# EAGLE design CO2 sensor v1.1_print (EAGLE 6.3)
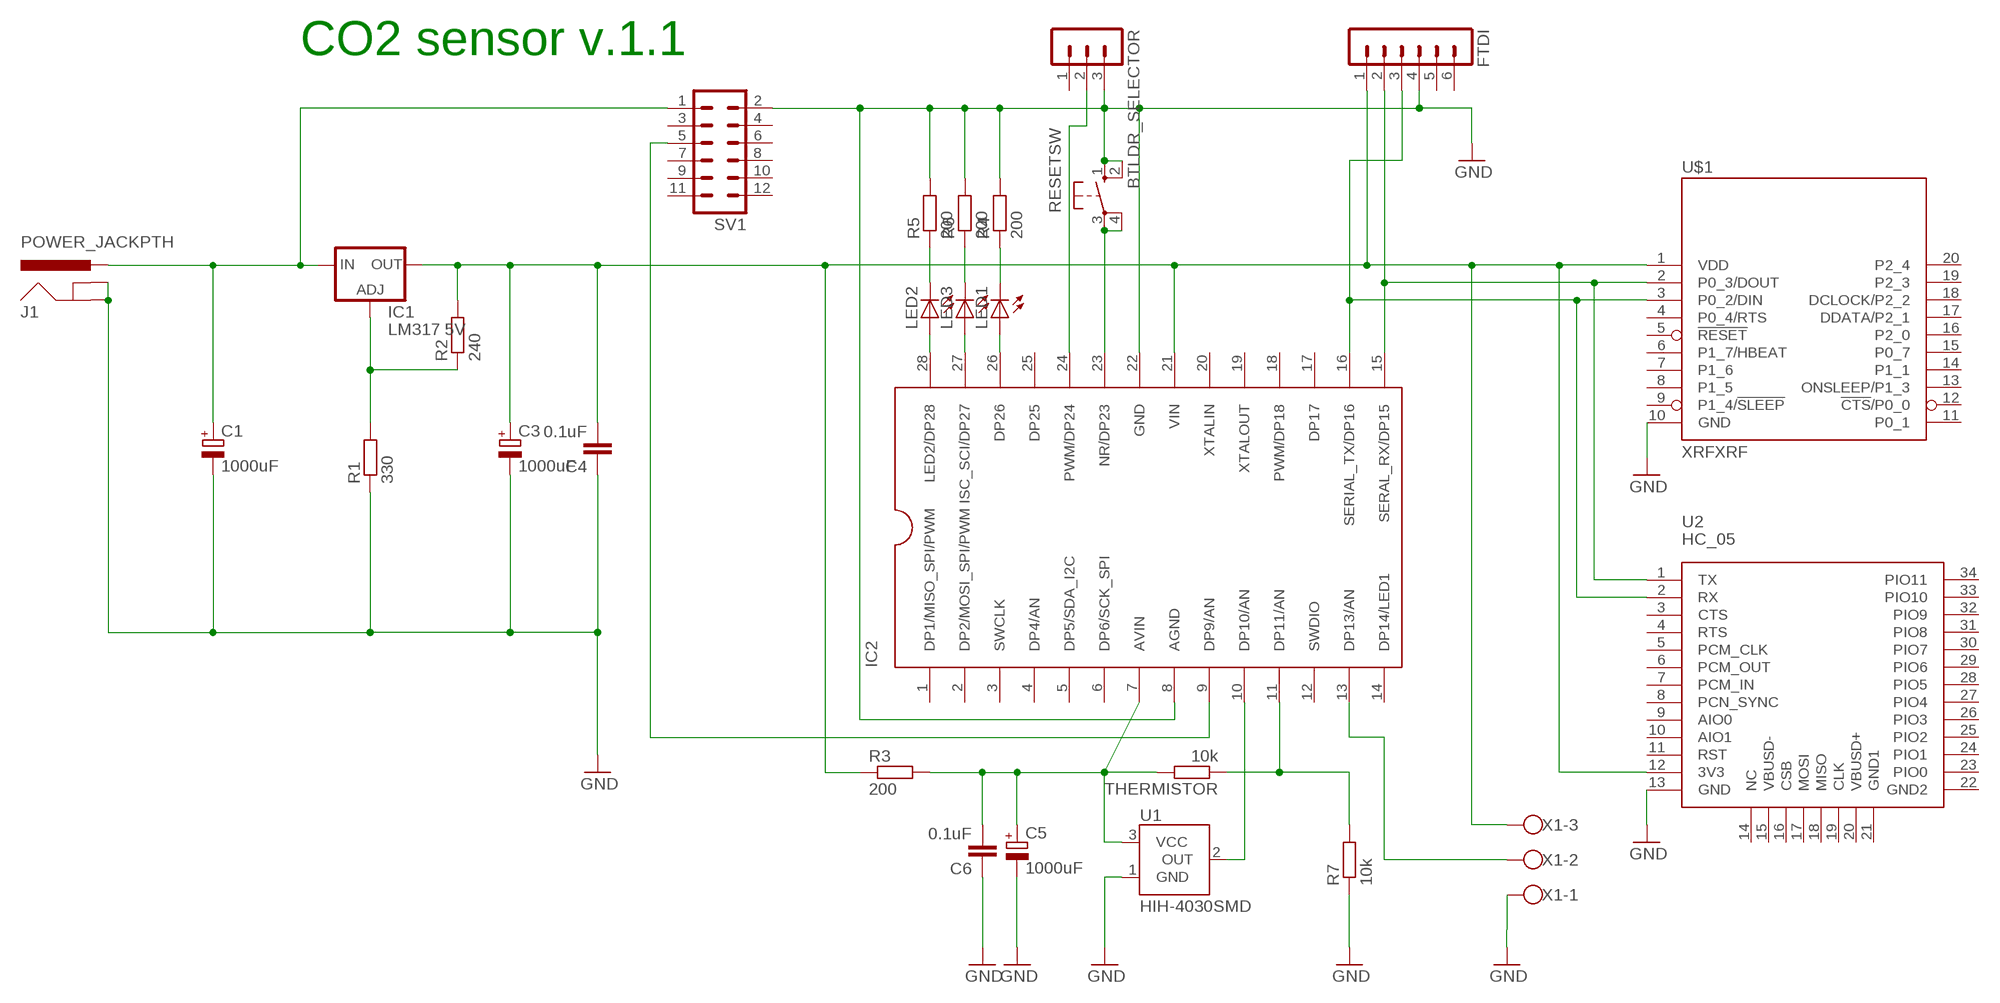
[diagram p0: schematic, sheet 1]

## Parts
BTLDR_SELECTOR  MA03-1  [MA03-1]
C1  1000uF  CPOL-EUE5-10.5  [E5-10,5]
C3  1000uF  CPOL-EUE5-10.5  [E5-10,5]
C4  0.1uF  C-EU050-025X075  [C050-025X075]
C5  1000uF  CPOL-EUE5-10.5  [E5-10,5]
C6  0.1uF  C-EU050-025X075  [C050-025X075]
FTDI  MA06-1  [MA06-1]
IC1  LM317 5V  LM317TL  [317TL]
IC2  LPC1114FN28  [DIP28]
J1  POWER_JACKPTH  [POWER_JACK_PTH]
LED1  LED3MM  [LED3MM]
LED2  LED3MM  [LED3MM]
LED3  LED3MM  [LED3MM]
R1  330  R-EU_0207/10  [0207/10]
R2  240  R-EU_0207/12  [0207/12]
R3  200  R-EU_0207/12  [0207/12]
R4  200  R-EU_0207/10  [0207/10]
R5  200  R-EU_0207/2V  [0207/2V]
R6  200  R-EU_0207/12  [0207/12]
R7  10k  R-EU_0207/12  [0207/12]
RESETSW  10-XX  [B3F-10XX]
SV1  MA06-2  [MA06-2]
THERMISTOR  10k  R-EU_0207/5V  [0207/5V]
U1  HIH-4030SMD  [HIH-4030]
U2  HC_05  [BLUETOOTH_SMD]
U$1  XRFXRF  [XRF]
X1  W237-103  [W237-103]

## Nets
GND: BTLDR_SELECTOR.3 C1.- C3.- C4.1 C5.- C6.1 FTDI.4 IC2.8(AGND) IC2.22(GND) J1.GND J1.GNDBREAK R1.1 R4.2 R5.2 R6.2 R7.1 RESETSW.1(S) RESETSW.2(S1) SV1.2 U1.1(GND) U2.13(GND) U$1.10(GND) X1.1
INPUT-CO2: IC2.9(DP9/AN) SV1.5
INPUT-T: IC2.11(DP11/AN) R7.2 THERMISTOR.1
INPUT-X: IC2.13(DP13/AN) X1.2
LM317-5V: IC1.1(ADJ) R1.2 R2.1
N$1: LED1.K(C) R4.1
N$2: IC2.28(LED2/DP28) LED2.A
N$3: C5.+ C6.2 IC2.7(AVIN) R3.2 THERMISTOR.2 U1.3(VCC)
N$4: IC2.27(ISC_SCI/DP27) LED3.A
N$5: IC2.26(DP26) LED1.A
N$6: FTDI.2 IC2.15(SERAL_RX/DP15) U2.1(TX) U$1.2(P0_3/DOUT)
N$7: FTDI.3 IC2.16(SERIAL_TX/DP16) U2.2(RX) U$1.3(P0_2/DIN)
N$8: IC2.10(DP10/AN) U1.2(OUT)
N$9: LED3.K(C) R6.1
N$10: LED2.K(C) R5.1
N$15: IC2.23(NR/DP23) RESETSW.3(P) RESETSW.4(P1)
N$20: BTLDR_SELECTOR.2 IC2.24(PWM/DP24)
V3.3: C3.+ C4.2 FTDI.1 IC1.2(OUT) IC2.21(VIN) R2.2 R3.1 U2.12(3V3) U$1.1(VDD) X1.3
V5: C1.+ IC1.3(IN) J1.PWR SV1.1
Unconnected: BTLDR_SELECTOR.1 FTDI.5 FTDI.6 IC2.1(DP1/MISO_SPI/PWM) IC2.2(DP2/MOSI_SPI/PWM) IC2.3(SWCLK) IC2.4(DP4/AN) IC2.5(DP5/SDA_I2C) IC2.6(DP6/SCK_SPI) IC2.12(SWDIO) IC2.14(DP14/LED1) IC2.17(DP17) IC2.18(PWM/DP18) IC2.19(XTALOUT) IC2.20(XTALIN) IC2.25(DP25) SV1.3 SV1.4 SV1.6 SV1.7 SV1.8 SV1.9 SV1.10 SV1.11 SV1.12 U2.3(CTS) U2.4(RTS) U2.5(PCM_CLK) U2.6(PCM_OUT) U2.7(PCM_IN) U2.8(PCN_SYNC) U2.9(AIO0) U2.10(AIO1) U2.11(RST) U2.14(NC) U2.15(VBUSD-) U2.16(CSB) U2.17(MOSI) U2.18(MISO) U2.19(CLK) U2.20(VBUSD+) U2.21(GND1) U2.22(GND2) U2.23(PIO0) U2.24(PIO1) U2.25(PIO2) U2.26(PIO3) U2.27(PIO4) U2.28(PIO5) U2.29(PIO6) U2.30(PIO7) U2.31(PIO8) U2.32(PIO9) U2.33(PIO10) U2.34(PIO11) U$1.4(P0_4/RTS) U$1.5(!RESET) U$1.6(P1_7/HBEAT) U$1.7(P1_6) U$1.8(P1_5) U$1.9(P1_4/!SLEEP) U$1.11(P0_1) U$1.12(!CTS!/P0_0) U$1.13(ONSLEEP/P1_3) U$1.14(P1_1) U$1.15(P0_7) U$1.16(P2_0) U$1.17(DDATA/P2_1) U$1.18(DCLOCK/P2_2) U$1.19(P2_3) U$1.20(P2_4)

## Notes on the sheet
- CO2 sensor v.1.1

## Library data of the parts
BTLDR_SELECTOR = con-lstb:MA03-1: PIN HEADER; OC_FARNELL: unknown; OC_NEWARK: unknown
C1 C3 C5 = rcl:CPOL-EU: POLARIZED CAPACITOR, European symbol
C4 C6 = rcl:C-EU: CAPACITOR, European symbol
FTDI = con-lstb:MA06-1: PIN HEADER; OC_FARNELL: unknown; OC_NEWARK: unknown
IC1 = v-reg:LM317TL: VOLTAGE REGULATOR
IC2 = lpc1114fn28:LPC1114FN28
J1 = SparkFun-Connectors:POWER_JACK: Power Jack This is the standard 5.5mm barrel jack for power. The PTH is the most common, proven, reliable, footprint. The Slot footprint only works if the mill layer is transmitted to the PCB fab house so be warned. Spark Fun Electronics SKU : PRT-00119 SMT: CONN-08106 Mating wall wart : TOL-00298 (and others)
LED1-LED3 = adafruit:LED: LED OSRAM: - CHIPLED LG R971, LG N971, LY N971, LG Q971, LY Q971, LO R971, LY R971 LH N974, LH R974 LS Q976, LO Q976, LY Q976 LO Q996 - Hyper CHIPLED LW Q18S LB Q993, LB Q99A, LB R99A - SideLED LS A670, LO A670, LY A670, LG A670, LP A670 LB A673, LV A673, LT A673, LW A673 LH A674 LY A675 LS A676, LA A676, LO A676, LY A676, LW A676 LS A679, LY A679, LG A679 - Hyper Micro SIDELED® LS Y876, LA Y876, LO Y876, LY Y876 LT Y87S - SmartLED LW L88C, LW L88S LB L89C, LB L89S, LG L890 LS L89K, LO L89K, LY L89K LS L896, LA L896, LO L896, LY L896 - TOPLED LS T670, LO T670, LY T670, LG T670, LP T670 LSG T670, LSP T670, LSY T670, LOP T670, LYG T670 LG T671, LOG T671, LSG T671 LB T673, LV T673, LT T673, LW T673 LH T674 LS T676, LA T676, LO T676, LY T676, LB T676, LH T676, LSB T676, LW T676 LB T67C, LV T67C, LT T67C, LS T67K, LO T67K, LY T67K, LW E67C LS E67B, LA E67B, LO E67B, LY E67B, LB E67C, LV E67C, LT E67C LW T67C LS T679, LY T679, LG T679 LS T770, LO T770, LY T770, LG T770, LP T770 LB T773, LV T773, LT T773, LW T773 LH T774 LS E675, LA E675, LY E675, LS T675 LS T776, LA T776, LO T776, LY T776, LB T776 LHGB T686 LT T68C, LB T68C - Hyper Mini TOPLED® LB M676 - Mini TOPLED Santana® LG M470 LS M47K, LO M47K, LY M47K Source: http://www.osram.convergy.de/
R1-R7 THERMISTOR = rcl:R-EU_: RESISTOR, European symbol
RESETSW = switch-omron:10-XX: OMRON SWITCH; MPN: B3F-1000; OC_FARNELL: 176432; OC_NEWARK: 36M3542
SV1 = con-lstb:MA06-2: PIN HEADER; OC_FARNELL: unknown; OC_NEWARK: unknown
U1 = SparkFun-Sensors VG:HIH-4030: Humidity Sensor
U2 = Bluetooth-HC05:HC_05: HC-05 Bluetooth Module
U$1 = Ciseco Footprints:XRF: XRF Wireless UART Serial Data Module. www.ciseco.co.uk
X1 = con-wago-500:W237-103: WAGO SCREW CLAMP; MPN: 237-103; OC_FARNELL: unknown; OC_NEWARK: 18M7116

## Board
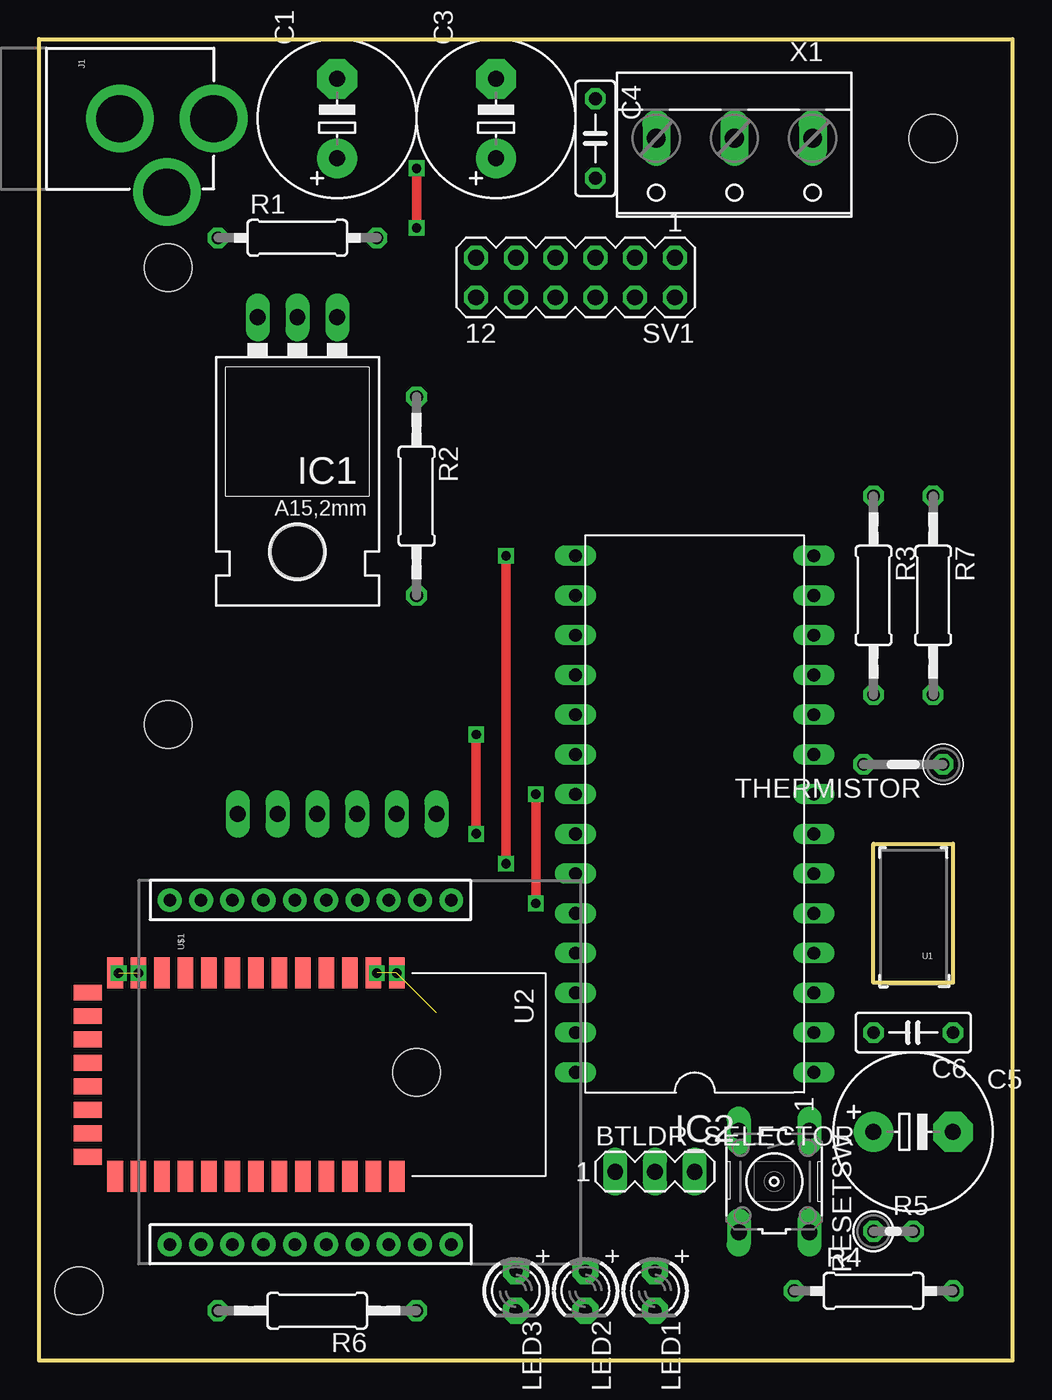
[diagram p1: board, top side]
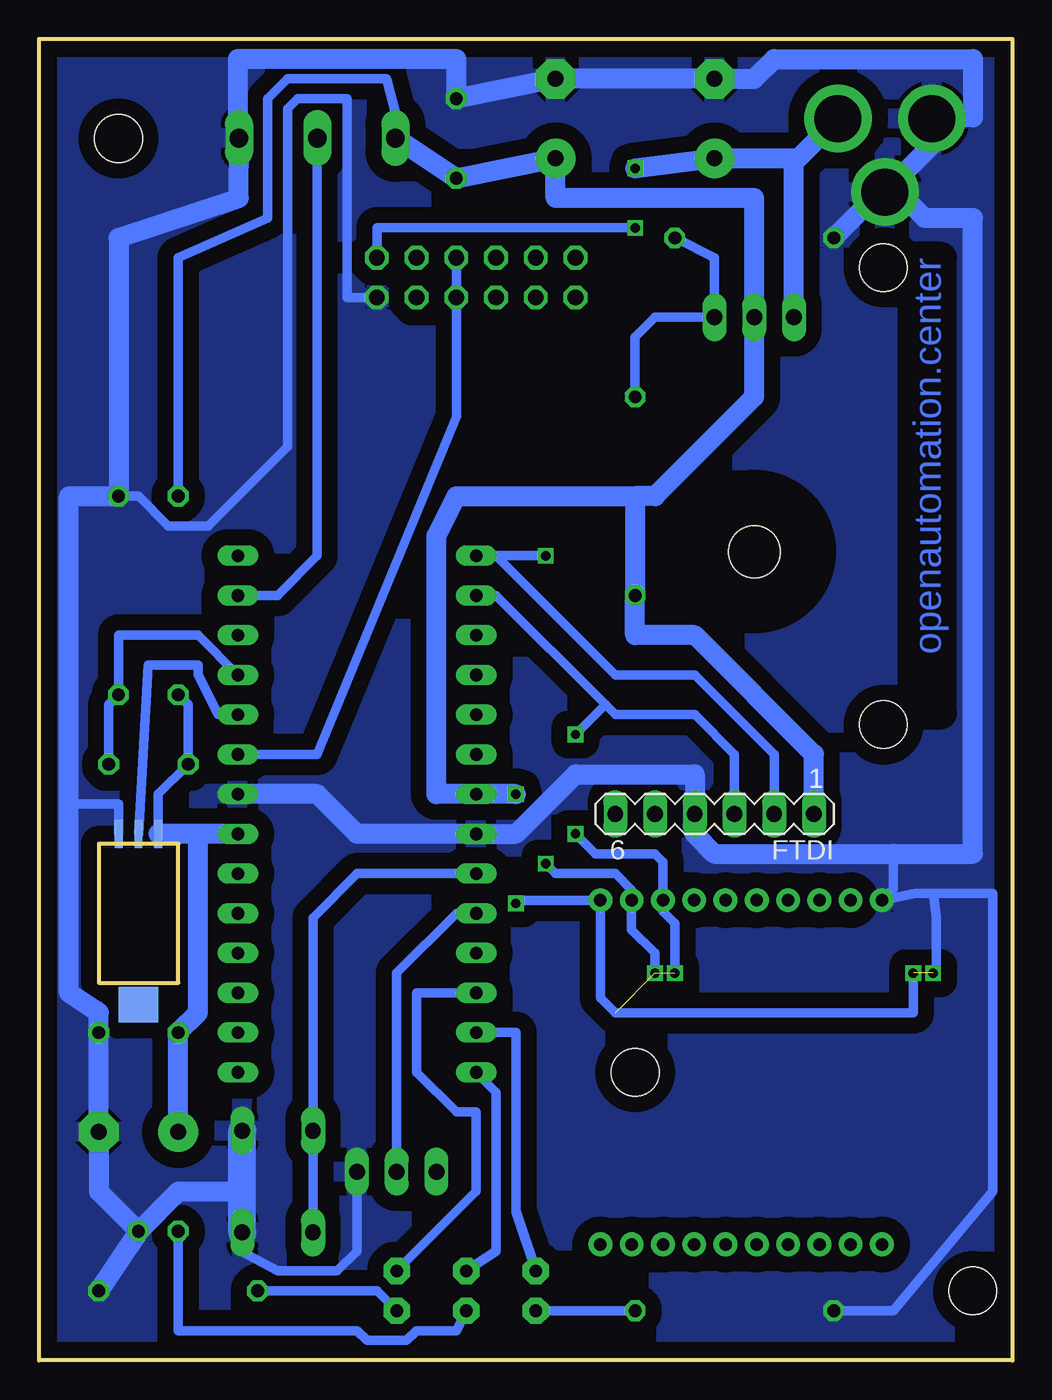
[diagram p2: board, bottom side, seen from below]

Size 62.23 x 84.45 mm. Coordinates in mm from the lower left corner, seen from the top.
Outline: 0,0 0,84.45 62.23,84.45 62.23,0 0,0
Outline: 53.34,33.02 58.42,33.02 58.42,24.13 53.34,24.13 53.34,33.02
Copper layers (1*16): Top 0.035mm / dielectric 1.5mm / Bottom 0.035mm
Design rules "default *": minimum track width 10mil, minimum drill 24mil, track to track 12mil, track to pad 12mil, pad to pad 12mil, via to via 12mil, smd to smd 12mil, copper to edge 40mil, drill to drill 8mil, minimum pad ring 10mil, minimum via ring 8mil, stop-mask expansion 4mil, vias tented up to drill 0mil, thermal gap 10mil
Holes 1.3 mm at 20.32,107.32
Holes 3.05 mm at 57.15,78.11 2.54,4.45 24.13,18.41 8.25,69.85 8.25,40.64

### Footprints (pad centres in the part's own frame; a part is rotated, then mirrored left to right if it is on the bottom)
MA03-1 = drill 1.016 long: 1 -2.54,0; 2 0,0; 3 2.54,0
E5-10,5 = drill 1.016 pad 2.54: + -2.54,0 | drill 1.016 pad 2.54 octagon: - 2.54,0
C050-025X075 = drill 0.813 octagon: 1 -2.54,0; 2 2.54,0
MA06-1 = drill 1.016 long: 1 -6.35,0; 2 -3.81,0; 3 -1.27,0; 4 1.27,0; 5 3.81,0; 6 6.35,0
317TL = drill 1.016 long: 1 -2.54,-3.81; 2 0,-3.81; 3 2.54,-3.81 | hole 3.302: 0,11.176
DIP28 = drill 0.813 long: 1 -16.51,-7.62; 2 -13.97,-7.62; 3 -11.43,-7.62; 4 -8.89,-7.62; 5 -6.35,-7.62; 6 -3.81,-7.62; 7 -1.27,-7.62; 8 1.27,-7.62; 9 3.81,-7.62; 10 6.35,-7.62; 11 8.89,-7.62; 12 11.43,-7.62; 13 13.97,-7.62; 14 16.51,-7.62; 15 16.51,7.62; 16 13.97,7.62; 17 11.43,7.62; 18 8.89,7.62; 19 6.35,7.62; 20 3.81,7.62; 21 1.27,7.62; 22 -1.27,7.62; 23 -3.81,7.62; 24 -6.35,7.62; 25 -8.89,7.62; 26 -11.43,7.62; 27 -13.97,7.62; 28 -16.51,7.62
POWER_JACK_PTH = drill 2.997 pad 4.318: GND 0,7.7; GNDBREAK 4.7,10.7; PWR 0,13.7
LED3MM = drill 0.813 pad 1.676 octagon: A -1.27,0; K 1.27,0
0207/10 = drill 0.813 octagon: 1 -5.08,0; 2 5.08,0
0207/12 = drill 0.813 octagon: 1 -6.35,0; 2 6.35,0
0207/2V = drill 0.813 octagon: 1 -1.27,0; 2 1.27,0
B3F-10XX = drill 1.016 long: 1 -3.251,2.261; 2 3.251,2.261; 3 -3.251,-2.261; 4 3.251,-2.261
MA06-2 = drill 1.016 octagon: 1 -6.35,-1.27; 2 -6.35,1.27; 3 -3.81,-1.27; 4 -3.81,1.27; 5 -1.27,-1.27; 6 -1.27,1.27; 7 1.27,-1.27; 8 1.27,1.27; 9 3.81,-1.27; 10 3.81,1.27; 11 6.35,-1.27; 12 6.35,1.27
0207/5V = drill 0.813 octagon: 1 -2.54,0; 2 2.54,0
HIH-4030 = smd 0.508 x 1.778 bottom: 1 -1.27,-5.08; 2 0,-5.08; 3 1.27,-5.08 | smd 2.54 x 2.286 bottom: NC 0,5.842
BLUETOOTH_SMD = smd 2 x 1: 1 -6.35,3.81; 2 -6.35,2.31; 3 -6.35,0.81; 4 -6.35,-0.69; 5 -6.35,-2.19; 6 -6.35,-3.69; 7 -6.35,-5.19; 8 -6.35,-6.69; 9 -6.35,-8.19; 10 -6.35,-9.69; 11 -6.35,-11.19; 12 -6.35,-12.69; 13 -6.35,-14.19; 22 6.65,-14.19; 23 6.65,-12.69; 24 6.65,-11.19; 25 6.65,-9.69; 26 6.65,-8.19; 27 6.65,-6.69; 28 6.65,-5.19; 29 6.65,-3.69; 30 6.65,-2.19; 31 6.65,-0.69; 32 6.65,0.81; 33 6.65,2.31; 34 6.65,3.81 | smd 1 x 1.8: 14 -5.1,-15.94; 15 -3.6,-15.94; 16 -2.1,-15.94; 17 -0.6,-15.94; 18 0.9,-15.94; 19 2.4,-15.94; 20 3.9,-15.94; 21 5.4,-15.94
XRF = drill 0.8 pad 1.524: 1 -11,20; 2 -11,18; 3 -11,16; 4 -11,14; 5 -11,12; 6 -11,10; 7 -11,8; 8 -11,6; 9 -11,4; 10 -11,2; 11 11,2; 12 11,4; 13 11,6; 14 11,8; 15 11,10; 16 11,12; 17 11,14; 18 11,16; 19 11,18; 20 11,20
W237-103 = drill 1.194 long: 1 -5,-1.29; 2 0,-1.29; 3 5,-1.29

### Placement (x,y rotation side)
BTLDR_SELECTOR  39.37,12.07 0 top
C1  19.05,79.38 90 top
C3  29.21,79.38 90 top
C4  35.56,78.11 270 top
C5  55.88,14.61 0 top
C6  55.88,20.95 180 top
FTDI  19.05,34.93 180 bottom
IC1  16.51,62.86 180 top
IC2  41.91,34.93 90 top
J1  -2.54,79.38 270 top
LED1  39.37,4.45 270 top
LED2  34.92,4.45 270 top
LED3  30.48,4.45 270 top
R1  16.51,71.75 0 top
R2  24.13,55.25 270 top
R3  53.34,48.89 270 top
R4  53.34,4.45 0 top
R5  54.61,8.26 0 top
R6  17.78,3.18 180 top
R7  57.15,48.89 270 top
RESETSW  46.99,11.43 270 top
SV1  34.29,69.22 180 top
THERMISTOR  55.24,38.1 180 top
U1  55.88,28.58 180 top
U2  19.05,18.41 270 top
U$1  6.35,18.41 270 top
X1  44.45,76.84 180 top

### Tracks (layer width: path | path; a pad name or v marks a point on that pad's centre or on a via)
GND  (1 unrouted)
  Bottom 0.61: X1.1 49.53,79.48 49.53,78.11 49.47,74.3 | SV1.2 42.54,67.95 42.54,80.64 45.72,80.64 46.35,80.01 46.35,58.42 51.43,53.34 53.97,53.34 55.88,55.25 R7.1 | BTLDR_SELECTOR.3 41.91,6.99 43.18,5.72 46.99,5.72 49.33,6.99 | 49.33,6.99 RESETSW.2 | 49.33,6.99 49.33,10.59 49.53,10.8 | U1.1 57.15,35.56 60.33,35.56 | U2.13 4.86,28.36 5.08,29.84 | 5.08,29.84 6.24,29.84 U$1.10 7.62,30.15 7.62,32.39 | R6.2 7.62,3.18 1.27,10.8 1.27,29.84 5.08,29.84
  Bottom 1.27: IC2.8 44.45,36.2 41.91,33.66 IC2.22 31.75,33.66 27.94,37.47 20.32,37.47 FTDI.4 20.32,33.66 19.05,32.39 7.62,32.39 2.54,32.39 2.54,73.03 5.62,73.03 7.27,74.67 J1.GNDBREAK | X1.1 49.47,74.3 57.15,71.75 R7.1 60.33,55.25 60.33,35.56 60.33,23.5 58.42,22.23 C6.1 C5.- 58.42,10.8 R5.2 | 49.53,79.48 49.53,83.19 35.56,83.19 C4.1 C3.- C1.- 16.51,81.92 15.24,83.19 2.54,83.19 2.54,79.45 J1.GND 5.16,77.67 J1.GNDBREAK | R5.2 R4.2 | R5.2 53.34,10.8 49.53,10.8 | R1.1 8.89,74.3 8.54,74.3 J1.GNDBREAK
  Bottom 1.778: RESETSW.2 RESETSW.1
  pour Bottom (isolate 1.016): 1.27,83.19 60.96,83.19 60.96,0.64 1.27,0.64
INPUT-CO2
  Bottom 0.61: IC2.9 44.45,38.73 35.56,60.33 SV1.5
INPUT-T
  Bottom 0.61: THERMISTOR.1 57.78,41.91 R7.2 57.15,46.36 52.07,46.36 IC2.11
INPUT-X
  Bottom 0.61: X1.2 44.45,51.44 46.99,48.89 IC2.13
LM317-5V
  Bottom 0.61: R2.1 24.13,65.41 22.86,66.67 IC1.1 19.05,70.48 R1.2
N$1
  Bottom 0.61: R4.1 40.64,4.45 LED1.K
N$2
  Bottom 0.61: LED2.A 33.02,6.99 33.02,17.15 IC2.28
N$3
  Bottom 0.61: U1.3 54.61,36.2 THERMISTOR.2 52.7,41.91 R3.2
  Bottom 1.27: IC2.7 52.07,33.66 | 52.07,33.66 U1.3 | C5.+ C6.2 52.07,22.23 52.07,33.66
N$4
  Bottom 0.61: IC2.27 31.75,20.95 31.75,9.53 LED3.A
N$5
  Bottom 0.61: LED1.A 34.29,10.8 34.29,15.88 35.56,15.88 38.1,18.41 38.1,23.5 IC2.26
N$6  (via drill 0.6)  (1 unrouted)
  Top 0.61: v29.85,31.75 v29.85,51.44
  Bottom 0.61: FTDI.2 15.24,38.73 20.32,43.81 25.4,43.81 33.02,51.44 IC2.15 v29.85,51.44 | v29.85,31.75 29.21,31.12 25.4,31.12 24.35,30.07 U$1.2 24.35,27.52 22.86,26.04 U2.1
N$7  (via drill 0.6)  (1 unrouted)
  Top 0.61: v27.94,33.66 v27.94,40.01
  Bottom 0.61: FTDI.3 17.78,38.73 20.32,41.27 25.4,41.27 26.04,41.91 | 26.04,41.91 33.02,48.89 IC2.16 | v27.94,33.66 26.67,32.39 22.86,32.39 22.35,31.88 U$1.3 22.35,28.7 21.59,27.94 21.59,25 U2.2 | v27.94,40.01 26.04,41.91
N$8
  Bottom 0.61: IC2.10 50.8,41.27 52.07,43.81 52.07,44.45 55.24,44.45 U1.2
N$9
  Bottom 0.61: LED3.K R6.1
N$10
  Bottom 0.61: R5.1 53.34,1.91 41.91,1.91 41.27,1.27 38.73,1.27 38.1,1.91 35.56,1.91 LED2.K
N$15
  Bottom 0.61: IC2.23 41.91,31.12 44.73,28.3 RESETSW.3 RESETSW.4
N$20
  Bottom 0.61: BTLDR_SELECTOR.2 39.37,24.77 35.56,28.58 IC2.24
V3.3  (via drill 0.6)  (3 unrouted)
  Top 0.61: v6.35,24.76 U2.12 | v31.75,29.21 v31.75,36.2
  Bottom 0.61: 39.39,78.12 X1.3 39.37,79.48 40,81.92 46.35,81.92 47.62,80.64 47.62,73.03 53.34,70.48 R3.1 | v6.35,24.76 6.35,22.23 25.4,22.23 26.35,23.18 U$1.1 31.54,29.41 v31.75,29.21
  Bottom 1.27: 39.39,78.12 C4.2 C3.+ 29.21,74.3 16.51,74.3 IC1.2 16.51,61.59 22.86,55.25 24.13,55.25 | 24.13,55.25 35.56,55.25 36.83,52.7 36.83,36.2 IC2.21 v31.75,36.2 | 24.13,55.25 R2.2 24.13,46.36 20.32,46.36 12.7,38.73 FTDI.1
  other vias: 5.08,24.76 21.59,24.76 22.86,24.76
V5  (via drill 0.6)
  Top 0.61: v24.13,72.39 v24.13,76.2
  Bottom 0.61: 13.97,76.84 13.97,76.56 | SV1.1 40.64,72.39 v24.13,72.39
  Bottom 1.27: IC1.3 13.97,76.84 C1.+ v24.13,76.2 | 13.97,76.56 J1.PWR

### Text on the board
Bottom: openautomation.center